# EAGLE board motor_power_avr (EAGLE 4.16)
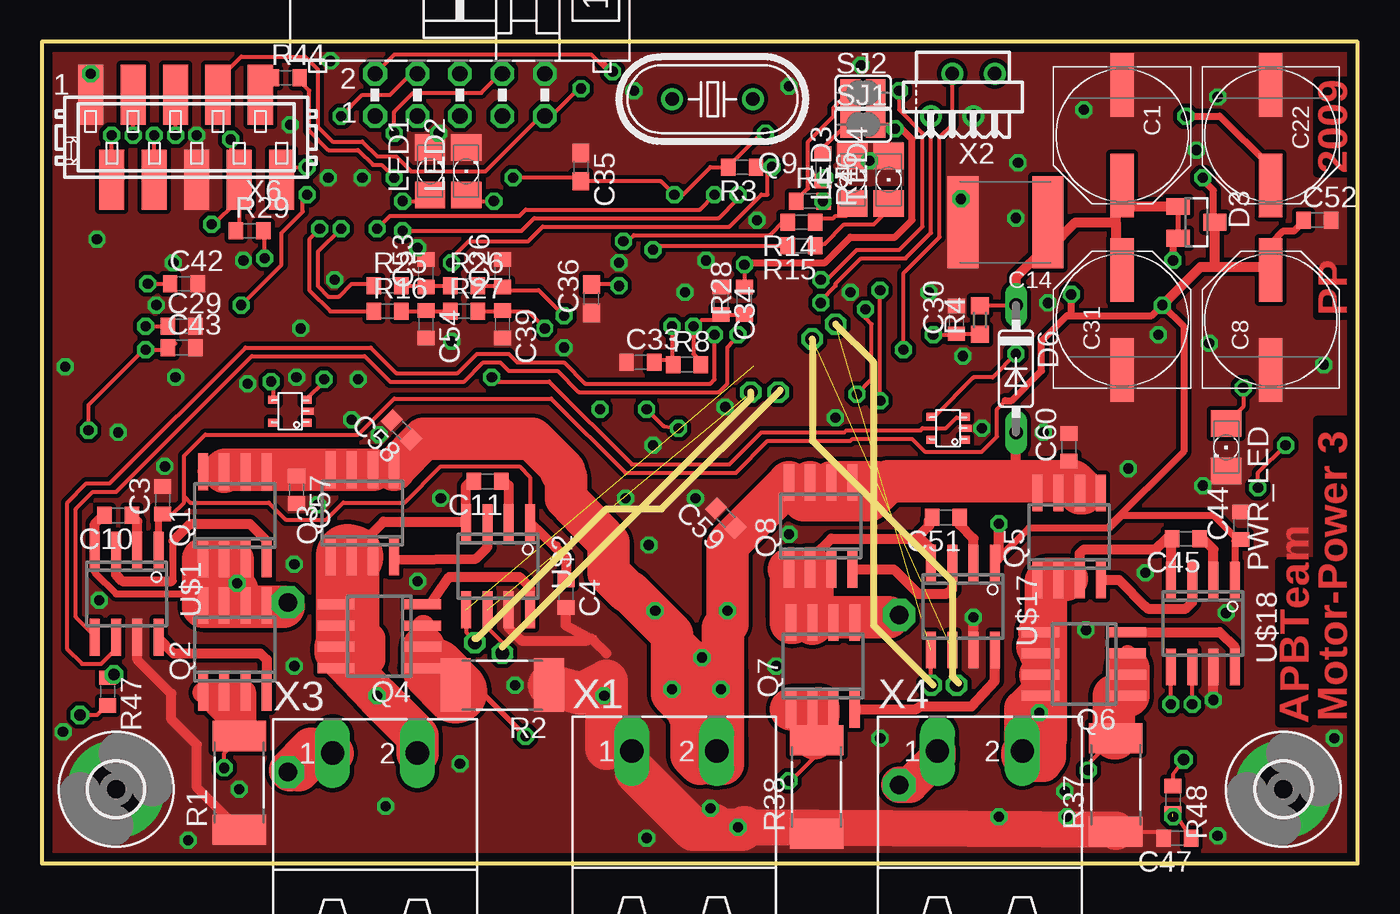
[diagram p1: board, top side]
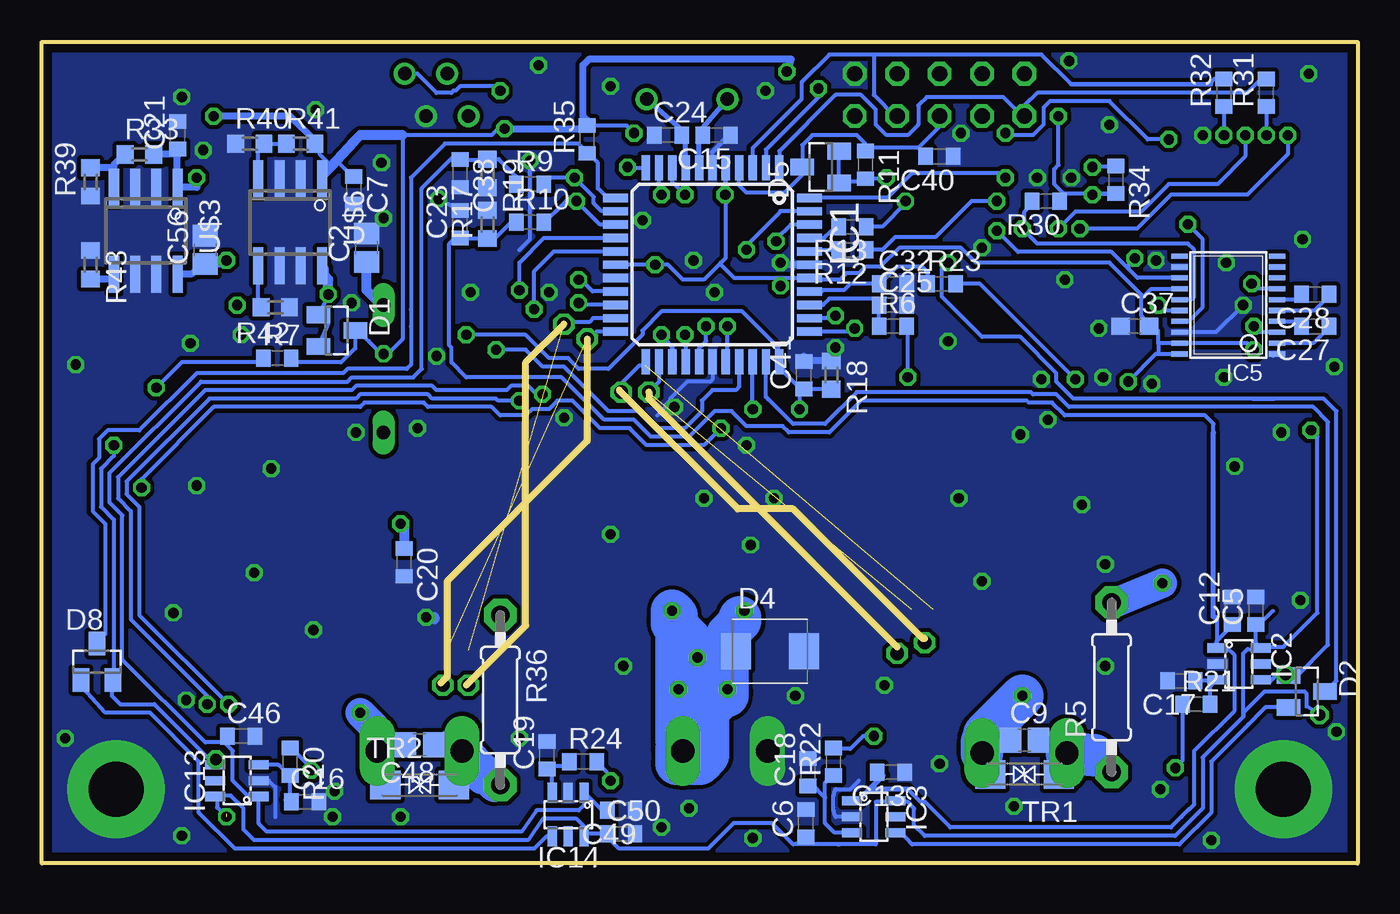
[diagram p2: board, bottom side, seen from below]

Size 78.74 x 49.15 mm. Coordinates in mm from the lower left corner, seen from the top.
Outline: 0,0 78.74,0 78.74,49.15 0,49.15 0,0
Copper layers (1*16): Top 0.035mm / dielectric 1.5mm / Bottom 0.035mm
Design rules "10mils": minimum track width 10mil, minimum drill 24mil, track to track 10mil, track to pad 10mil, pad to pad 10mil, via to via 10mil, smd to smd 0mil, copper to edge 20mil, drill to drill 10mil, minimum pad ring 10mil, minimum via ring 8mil, stop-mask expansion 0mil, vias tented up to drill 0mil, thermal gap 10mil
Milling: 13 lines

## Footprints (pad centres in the part's own frame; a part is rotated, then mirrored left to right if it is on the bottom)
PANASONIC_E = smd 3.8 x 1.4: + 3,0; - -3,0
C0805 = smd 1.3 x 1.5: 1 -0.85,0; 2 0.85,0
0603_SMALL = smd 0.864 x 1.016: 1 -0.825,0; 2 0.825,0
C2220K = smd 1.85 x 5.5: 1 -2.55,0; 2 2.55,0
C0603 = smd 1.1 x 1: 1 -0.85,0; 2 0.85,0
SOT23 = smd 1 x 1.4: 1 -0.95,-1.1; 2 0.95,-1.1; 3 0,1.1
SMBJ = smd 1.78 x 2.16: A 2.04,0; C -2.03,0
DO35-7 = drill 0.813 long: A 3.81,0; C -3.81,0
3,3-PAD = drill 3.3 pad 5.842 round: B3,3 0,0
TQFP44 = smd 1.5 x 0.5: 1 -5.8,4; 2 -5.8,3.2; 3 -5.8,2.4; 4 -5.8,1.6; 5 -5.8,0.8; 6 -5.8,0; 7 -5.8,-0.8; 8 -5.8,-1.6; 9 -5.8,-2.4; 10 -5.8,-3.2; 11 -5.8,-4; 23 5.8,-4; 24 5.8,-3.2; 25 5.8,-2.4; 26 5.8,-1.6; 27 5.8,-0.8; 28 5.8,0; 29 5.8,0.8; 30 5.8,1.6; 31 5.8,2.4; 32 5.8,3.2; 33 5.8,4 | smd 0.5 x 1.5: 12 -4,-5.8; 13 -3.2,-5.8; 14 -2.4,-5.8; 15 -1.6,-5.8; 16 -0.8,-5.8; 17 0,-5.8; 18 0.8,-5.8; 19 1.6,-5.8; 20 2.4,-5.8; 21 3.2,-5.8; 22 4,-5.8; 34 4,5.8; 35 3.2,5.8; 36 2.4,5.8; 37 1.6,5.8; 38 0.8,5.8; 39 0,5.8; 40 -0.8,5.8; 41 -1.6,5.8; 42 -2.4,5.8; 43 -3.2,5.8; 44 -4,5.8
SOT23-6 = smd 0.55 x 1.2: 1 -0.95,-1.3; 2 0,-1.3; 3 0.95,-1.3; 4 0.95,1.3; 5 0,1.303; 6 -0.95,1.3
TSSOP20 = smd 0.305 x 0.991: 1 -2.925,-2.918; 2 -2.275,-2.918; 3 -1.625,-2.918; 4 -0.975,-2.918; 5 -0.325,-2.918; 6 0.325,-2.918; 7 0.975,-2.918; 8 1.625,-2.918; 9 2.275,-2.918; 10 2.925,-2.918; 11 2.925,2.918; 12 2.275,2.918; 13 1.625,2.918; 14 0.975,2.918; 15 0.325,2.918; 16 -0.325,2.918; 17 -0.975,2.918; 18 -1.625,2.918; 19 -2.275,2.918; 20 -2.925,2.918
SOT363-5 = smd 0.6 x 0.48: 1 -1,0.7; 3 -1,-0.7; 4 1,-0.7; 5 1,0.7 | smd 0.7 x 0.4: 2 -1.05,0
1206 = smd 1.6 x 1.803: A -1.422,0; C 1.422,0
SO-08 = smd 0.6 x 2.2: 1 -1.905,-2.6; 2 -0.635,-2.6; 3 0.635,-2.6; 4 1.905,-2.6; 5 1.905,2.6; 6 0.635,2.6; 7 -0.635,2.6; 8 -1.905,2.6
HC49U70 = drill 0.813 round: 1 -2.413,0; 2 2.413,0
R2512 = smd 1.8 x 3.2: 1 -2.8,0; 2 2.8,0
R0603 = smd 1 x 1.1: 1 -0.85,0; 2 0.85,0
0207/10 = drill 1.1 pad 1.93 octagon: 1 -5.08,0; 2 5.08,0
SJ = smd 1.168 x 1.6: 1 -0.762,0; 2 0.762,0
ML10L = drill 0.914 octagon: 1 -5.08,-1.27; 2 -5.08,1.27; 3 -2.54,-1.27; 4 -2.54,1.27; 5 0,-1.27; 6 0,1.27; 7 2.54,-1.27; 8 2.54,1.27; 9 5.08,-1.27; 10 5.08,1.27
DO214AC_BIDIR = smd 1.8 x 1.7: P$1 -2.05,0; P$2 2.05,0
SO08 = smd 0.6 x 2.2: 1 -1.905,-2.6; 2 -0.635,-2.6; 3 0.635,-2.6; 4 1.905,-2.6; 5 1.905,2.6; 6 0.635,2.6; 7 -0.635,2.6; 8 -1.905,2.6
MSTBA2 = drill 1.397 long: 1 -2.54,5.08; 2 2.54,5.08
MICROMATCH-4-SIDE = drill 0.813 round: 1 1.905,1.27; 2 0.635,-1.27; 3 -0.635,1.27; 4 -1.905,-1.27
MICROMATCH-10-SMD = smd 1.5 x 3.58: 1 5.715,-2.54; 2 4.445,2.54; 3 3.175,-2.54; 4 1.905,2.54; 5 0.635,-2.54; 6 -0.635,2.54; 7 -1.905,-2.54; 8 -3.175,2.54; 9 -4.445,-2.54; 10 -5.715,2.54

## Placement (x,y rotation side)
C1  22µ/50V  [PANASONIC_E]  64.64,43.56 270 top
C2  100n/50V  [C0805]  59.31,36.83 90 bottom
C3  1u  [0603_SMALL]  7.24,21.72 90 top
C4  1u  [0603_SMALL]  31.37,16.13 270 top
C5  220n  [0603_SMALL]  6.1,15.11 90 bottom
C6  220n  [0603_SMALL]  33.02,2.41 90 bottom
C7  10u  [0603_SMALL]  60.07,40.26 270 bottom
C8  100µ  [PANASONIC_E]  73.53,32.51 90 top
C9  100n/50V  [C0805]  19.94,7.37 0 bottom
C10  220n  [0603_SMALL]  4.57,20.83 180 top
C11  220n  [0603_SMALL]  26.67,22.86 180 top
C12  220n  [0603_SMALL]  7.49,15.11 90 bottom
C13  220n  [0603_SMALL]  27.94,5.46 180 bottom
C14  10µ/50V  [C2220K]  57.66,38.35 180 top
C15  22p  [0603_SMALL]  38.35,43.56 180 bottom
C16  220p  [0603_SMALL]  62.99,3.68 0 bottom
C17  220p  [0603_SMALL]  10.54,10.92 180 bottom
C18  220p  [0603_SMALL]  32.89,5.46 90 bottom
C19  220p  [0603_SMALL]  48.51,6.48 90 bottom
C20  1u  [0603_SMALL]  57.07,18 270 bottom
C21  10u  [0603_SMALL]  70.61,43.56 90 bottom
C22  47µ  [PANASONIC_E]  73.53,43.56 270 top
C23  1u  [0603_SMALL]  53.72,38.23 90 bottom
C24  22p  [0603_SMALL]  41.27,43.56 0 bottom
C25  220n  [0603_SMALL]  27.81,33.4 0 bottom
C26  10n  [0603_SMALL]  27.56,35.31 90 top
C27  100n  [0603_SMALL]  2.54,32.13 180 bottom
C28  330n  [0603_SMALL]  2.54,34.04 180 bottom
C29  330n  [0603_SMALL]  8.38,32.13 0 top
C30  10n  [0603_SMALL]  54.74,32.51 90 top
C31  22µ/50V  [PANASONIC_E]  64.64,32.51 90 top
C32  220n  [0603_SMALL]  27.81,34.67 0 bottom
C33  220n  [0603_SMALL]  35.81,29.97 0 top
C34  220n  [0603_SMALL]  40.64,33.66 270 top
C35  220n  [C0603]  32.26,41.66 270 top
C36  220n  [C0603]  32.89,33.78 90 top
C37  220n  [C0603]  13.34,32.13 0 bottom
C38  1u  [0603_SMALL]  53.72,41.27 270 bottom
C39  10n  [0603_SMALL]  27.56,32.26 270 top
C40  220n  [0603_SMALL]  25.02,42.29 180 bottom
C41  10n  [0603_SMALL]  33.15,29.21 90 bottom
C42  330n  [0603_SMALL]  8.51,34.67 0 top
C43  220n  [0603_SMALL]  8.38,30.86 0 top
C44  1u  [0603_SMALL]  71.75,20.19 90 top
C45  220n  [0603_SMALL]  68.45,19.43 180 top
C46  220n  [0603_SMALL]  66.8,7.62 0 bottom
C47  220n  [0603_SMALL]  67.94,1.52 180 top
C48  100n/50V  [C0805]  56.13,7.11 180 bottom
C49  220n  [0603_SMALL]  44.07,3.17 180 bottom
C50  220n  [0603_SMALL]  44.07,1.78 0 bottom
C51  220n  [0603_SMALL]  54.1,20.7 180 top
C52  1u  [0603_SMALL]  76.33,38.48 0 top
C53  10n  [0603_SMALL]  22.99,35.31 90 top
C54  10n  [0603_SMALL]  22.99,32.26 270 top
C56  100n/50V  [C0805]  68.96,36.7 90 bottom
C57  10n  [0603_SMALL]  15.24,22.35 270 top
C58  10n  [0603_SMALL]  21.52,25.92 135 top
C59  10n  [0603_SMALL]  40.93,20.66 135 top
C60  10n  [0603_SMALL]  61.47,24.89 90 top
D1  [SOT23]  61.09,31.88 270 bottom
D2  [SOT23]  3.05,10.29 270 bottom
D3  [SOT23]  69.09,38.35 270 top
D4  SMBJ28A  [SMBJ]  35.18,12.7 0 bottom
D5  [SOT23]  32.13,41.66 90 bottom
D6  1N5819  [DO35-7]  58.29,29.59 270 top
D8  [SOT23]  75.44,12.06 0 bottom
H1  MOUNT-PAD-ROUND3.3  [3,3-PAD]  4.45,4.45 0 top
H2  MOUNT-PAD-ROUND3.3  [3,3-PAD]  74.3,4.45 0 top
IC1  MEGA16-A  [TQFP44]  38.61,35.81 270 bottom
IC2  LM331DBV  [SOT23-6]  7.11,11.94 270 bottom
IC3  LM331DBV  [SOT23-6]  28.96,2.79 270 bottom
IC5  MAX3223EUP  [TSSOP20]  7.75,33.4 90 bottom
IC8  MCP9701"  [SOT363-5]  54.23,26.04 180 top
IC10  MCP9701"  [SOT363-5]  14.86,27.05 180 top
IC13  LM331DBV  [SOT23-6]  67.06,4.95 90 bottom
IC14  LM331DBV  [SOT23-6]  47.24,2.92 180 bottom
LED1  [1206]  23.24,41.4 90 top
LED2  [1206]  25.4,41.4 90 top
LED3  [1206]  48.51,40.89 90 top
LED4  [1206]  50.67,40.89 90 top
PWR_LED  [1206]  70.87,24.89 270 top
Q1  [SO-08]  11.56,20.83 0 top
Q2  [SO-08]  11.56,12.83 0 top
Q3  [SO-08]  19.18,20.95 0 top
Q4  [SO-08]  20.19,13.59 90 top
Q5  [SO-08]  61.47,19.56 0 top
Q6  [SO-08]  62.36,11.94 90 top
Q7  [SO-08]  46.74,11.81 0 top
Q8  [SO-08]  46.61,20.19 0 top
Q9  14.7456M  [HC49U70]  40.13,45.72 180 top
R1  5mOhm  [R2512]  11.81,4.83 90 top
R2  5mOhm  [R2512]  27.56,10.67 180 top
R3  1k  [0603_SMALL]  41.91,41.66 180 top
R4  464k  [R0603]  56.13,32.51 90 top
R5  Polys_15A  [0207/10]  14.73,10.54 90 bottom
R6  1k  [0603_SMALL]  27.81,32.13 0 bottom
R7  2.15k  [0603_SMALL]  64.64,30.23 0 bottom
R8  10k  [0603_SMALL]  38.61,29.84 0 top
R9  46.4k  [0603_SMALL]  49.53,40.64 0 bottom
R10  46.4k  [0603_SMALL]  49.53,38.35 0 bottom
R11  10k  [0603_SMALL]  29.46,41.78 270 bottom
R12  2.15k  [0603_SMALL]  30.23,36.7 180 bottom
R13  2.15k  [0603_SMALL]  30.23,38.1 180 bottom
R14  2.15k  [0603_SMALL]  45.47,38.35 180 top
R15  2.15k  [0603_SMALL]  45.47,36.96 180 top
R16  21.5k  [0603_SMALL]  20.7,33.02 0 top
R17  1k  [R0603]  52.07,38.23 90 bottom
R18  100k  [R0603]  31.5,29.21 270 bottom
R19  1k  [R0603]  52.07,41.27 270 bottom
R20  4.64k  [0603_SMALL]  63.88,6.1 270 bottom
R21  4.64k  [0603_SMALL]  9.65,9.53 0 bottom
R22  4.64k  [0603_SMALL]  31.37,6.1 90 bottom
R23  1k  [0603_SMALL]  24.89,34.67 0 bottom
R24  4.64k  [0603_SMALL]  46.35,6.1 0 bottom
R25  21.5k  [0603_SMALL]  20.7,34.54 0 top
R26  10k  [0603_SMALL]  25.27,34.54 0 top
R27  10k  [0603_SMALL]  25.27,33.02 0 top
R28  10  [0603_SMALL]  42.04,33.66 90 top
R29  2.15k*  [0603_SMALL]  12.45,37.85 0 top
R30  2.15k*  [0603_SMALL]  18.67,39.62 180 bottom
R31  2.15k  [0603_SMALL]  5.46,46.1 90 bottom
R32  2.15k  [0603_SMALL]  8,46.1 90 bottom
R33  68k  [R0603]  72.9,42.42 0 bottom
R34  2.15k  [0603_SMALL]  14.48,40.89 270 bottom
R35  1k  [0603_SMALL]  46.1,43.31 90 bottom
R36  Polys_15A  [0207/10]  51.31,9.78 270 bottom
R37  5mOhm  [R2512]  64.26,4.7 90 top
R38  5mOhm  [R2512]  46.35,4.57 90 top
R39  10k  [R0603]  75.82,40.77 90 bottom
R40  10k  [R0603]  66.29,43.05 0 bottom
R41  31.7k  [R0603]  63.25,43.05 0 bottom
R42  2.15k  [R0603]  64.77,33.27 180 bottom
R43  2.15k  [R0603]  75.82,35.81 270 bottom
R44  2.15k  [0603_SMALL]  14.61,46.99 0 top
R45  2.15k  [0603_SMALL]  45.97,39.62 0 top
R46  2.15k  [0603_SMALL]  46.74,41.66 270 top
R47  1k  [0603_SMALL]  3.94,10.29 270 top
R48  1k  [0603_SMALL]  67.69,3.81 270 top
SJ1  [SJ]  49.15,44.2 0 top
SJ2  [SJ]  49.15,46.1 0 top
SV1  [ML10L]  25.02,45.97 0 top
TR1  SMAJ30CA-TR__DO214AC  [DO214AC_BIDIR]  19.94,5.33 180 bottom
TR2  SMAJ30CA-TR__DO214AC  [DO214AC_BIDIR]  56.13,4.7 0 bottom
U$1  ISL2110SOIC  [SO08]  5.08,16.13 180 top
U$2  ISL2110SOIC  [SO08]  27.3,17.78 180 top
U$3  LM2931ADJD  [SO08]  72.52,37.85 180 bottom
U$6  LM2931ADJD  [SO08]  63.88,38.35 180 bottom
U$17  ISL2110SOIC  [SO08]  55.12,15.37 180 top
U$18  ISL2110SOIC  [SO08]  69.47,14.35 180 top
X1  MSTBA2  [MSTBA2]  37.85,1.65 0 top
X2  MICROMATCH-4-SIDE  [MICROMATCH-4-SIDE]  55.12,45.97 180 top
X3  MSTBA2  [MSTBA2]  19.94,1.52 0 top
X4  MSTBA2  [MSTBA2]  56.13,1.65 0 top
X6  MICROMATCH-10-SMD  [MICROMATCH-10-SMD]  8.64,43.43 180 top

## Tracks (layer width: path | path; a pad name or v marks a point on that pad's centre or on a via)
0V  (via drill 0.61, 0.61 pad 0.81)
  Top 0.254: 12.13,1.97 12,2.1 R1.1 | C47.2 66.74,1.91 65.79,1.91 R37.1 | C14.2 54.98,38.47 54.99,38.48 54.86,38.61 v54.99,39.75 | LED4.C 49.55,42.32 v49.53,42.04
  Top 0.406: v34.54,35.94 34.8,35.94
  Top 0.61: U$2.7 27.94,14.1 28.7,13.34 32.64,13.34 32.77,13.46 32.89,13.46 33.02,13.34 | 33.02,13.34 33.78,12.57 | C4.2 31.37,14.22 33.02,13.34 | U$17.7 v55.75,14.73 | v70.1,9.78 U$18.7 | U$1.7 5.71,12.19 7.75,10.16 7.75,8.64 9.27,7.11 9.27,4.57 R1.1
  Top 1.27: 12.2,2.04 12.13,1.97 11.94,1.78
  Top 2.184: 42.04,2.16 64.26,2.03 R37.1
  Top 2.54: R2.1 32.26,10.16 33.78,10.92 33.78,6.86 | 40.01,2.03 38.99,2.03 35.56,5.46 | 40.01,2.03 41.9,2.03 42.04,2.16 | 40.26,2.29 40.01,2.03
  Bottom 0.254: 6.22,16 6.16,15.94 C5.2 | IC13.2 65.15,4.95 64.77,4.57 64.77,2.79 | C23.2 54.17,39.31 v54.99,39.75 | IC5.18 8.48,31.78 v6.86,33.4 | v55.12,30.35 55.12,30.61 | IC1.28 38.61,28.96 38.73,28.83 40.13,28.83 41.15,27.81 41.15,27.69 41.4,27.43 41.4,27.3 41.91,26.8 | IC3.2 31.24,2.79 31.37,3.17 31.37,4.06 31.24,4.45 30.35,4.45 29.84,4.95 | IC1.6 38.61,42.55 | 5.2,30.48 5.21,30.48 | IC5.1 5.2,30.48 | 5.2,30.48 5.08,30.35 | v49.53,42.04 49.53,37.34 50.16,36.7
  Bottom 0.305: 38.61,42.55 37.85,43.31
  Bottom 0.406: 33.27,30.04 33.27,29.97 | 33.27,30.04 C41.2 33.15,30.35 | R18.1 33.27,30.06 33.27,30.04 | IC1.39 34.42,35.81 v34.54,35.94
  Bottom 0.61: v55.75,14.73 55.24,14.73 55.24,14.61 | v70.1,9.78 69.98,9.78
  other vias: 41.66,2.16 12.06,36.07 62.36,45.09 58.42,41.91 66.8,31.62 69.85,31.11 76.71,29.84 7.37,23.75 15.11,11.81 1.27,7.87 1.4,29.72 8,29.08 11.81,4.45 20.57,3.43 77.34,7.49 62.48,13.97 57.28,2.79 28.32,10.67 38.48,34.16 24.51,31.24 15.49,32 35.43,46.23 49.02,47.75 47.5,26.67 40.89,27.3 3.43,15.75 4.57,25.78 39.12,21.84 36.32,19.05 18.54,26.54 18.92,28.96 15.11,17.91 22.48,16.89 25.02,5.97 40.01,3.3 66.04,17.4 65.02,23.62 69.47,22.61 69.09,42.67 12.32,28.7 33.66,10.03 43.94,11.81 70.87,14.99 16.51,21.46 59.94,25.78 42.8,38.48 44.7,46.48 60.2,33.53 36.2,1.52 20.19,25.65 48.39,34.16 53.09,34.16 3.3,37.34 7.87,35.94 17.14,41.02 9.27,43.56 2.92,47.24 19.18,41.02 23.75,43.69 14.86,44.2 39.75,36.07 31.24,30.86 23.88,21.84 17.27,48.01 61.34,2.79 61.21,4.32 50.16,7.49 15.24,29.08 17.53,34.92 22.48,36.83 44.7,19.68 8.76,1.4 70.36,1.65 58.29,38.61 70.36,45.85 36.58,25.02 34.92,21.84 56.26,26.04
  pour Bottom (isolate 0.254, no thermals): 0.51,0.51 78.23,0.51 78.23,48.64 0.51,48.64
  pour Top (isolate 0.254, no thermals): 0.25,0.25 78.49,0.25 78.49,48.9 0.25,48.9
+5V  (via drill 0.61, 0.61 pad 1.02, 0.7 pad 1.02)  (1 unrouted)
  Top 0.254: 68.71,1.52 C47.1 67.94,2.79 v67.69,2.79 | 7.49,30.73 v6.22,30.73 6.1,30.73 2.79,27.43 v2.79,25.91 | 7.49,30.73 7.62,30.86 | 7.49,30.73 7.56,30.8 C43.1 7.62,30.86 | IC10.4 13.86,28.72 v13.72,28.83 | 42.04,35.69 R28.2 | IC8.4 53.41,26.73 55.75,29.08 56.9,29.08 v58.29,30.48 | v28.19,41.02 28.45,41.15 28.45,41.02 31.75,41.02 C35.2 37.05,40.81 v37.85,40.01 38.35,40.01 40.01,41.66 41.02,41.66 | C36.2 34.46,34.63 v34.54,34.54 | 8,31.11 7.87,31.11 7.62,30.86 | 33.66,47.75 33.53,47.75 32.89,48.39 21.08,48.39 SV1.2 | 41.02,41.66 R3.2 | 41.02,41.66 43.05,43.69 v43.31,43.69 | SJ1.2 50.8,44.2 v51.05,43.94 | SJ1.2 49.91,45.97 | 49.4,46.74 49.4,45.47 49.91,45.97 | 49.4,44.58 49.4,43.56 | 49.91,45.97 SJ2.2 | SJ1.2 49.78,44.2 49.4,44.58 | 49.4,44.58 49.4,44.83 | R47.2 3.94,9.53 3.3,8.89 v2.29,8.89
  Top 0.406: 42.04,35.69 v42.04,35.81 41.91,35.81 42.04,35.94 46.86,35.94 48.39,37.47 51.05,37.47 52.07,38.48 52.07,43.31 51.31,44.07 50.8,44.07 v51.05,43.94 | v34.16,47.37 34.04,47.37 33.66,47.75 | v68.45,44.7 70.48,44.7 73.41,41.78 73.41,40.77 73.53,40.64 C22.+
  Bottom 0.254: 46.23,1.65 46.26,1.62 IC14.6 46.23,1.62 46.23,1.78 | IC2.6 5.81,12.92 6.1,13.21 C5.1 5.91,14.29 5.08,15.11 | 30.99,1.14 28.83,1.14 28.83,3.68 27.81,3.68 | 30.99,1.14 31.11,1.14 | IC2.6 5.91,12.89 5.97,12.83 6.6,12.83 6.86,12.57 6.86,8.76 | 27.81,3.68 27.75,3.74 IC3.6 | 27.81,3.68 26.92,3.68 26.54,3.3 26.54,2.29 25.91,1.65 10.92,1.65 9.27,3.3 9.27,6.35 6.86,8.76 | 30.99,1.14 33.78,1.14 | 33.78,1.14 35.05,2.41 37.34,2.41 38.86,0.89 44.2,0.89 44.83,1.52 C50.1 46.23,1.78 | 68.58,4.06 68.61,4.03 IC13.6 68.26,4 | 68.26,4 68.2,4.06 67.44,4.06 66.67,3.3 66.67,2.03 66.04,1.4 49.66,1.4 48.77,2.67 46.74,2.67 46.23,2.16 46.23,1.78 | 68.26,4 68.26,3.36 v67.69,2.79 | 34.29,35.01 IC1.38 32.13,34.92 30.99,34.92 30.61,35.31 29.84,35.31 29.46,35.69 28.57,35.69 27.43,36.83 23.75,36.83 22.86,35.94 14.86,35.94 12.83,33.91 | 34.29,35.01 37.3,35.01 38.1,35.81 38.1,35.94 | v42.04,35.81 IC1.17 | 38.1,35.94 37.81,36.23 IC1.5 37.81,41.49 37.72,41.4 37.85,41.27 v37.85,40.01 | R11.2 29.46,41.15 | 5.96,30.48 v6.22,30.73 6.62,31.13 IC5.19 10.66,31.12 10.67,31.11 11.94,31.11 | 11.94,31.11 11.94,30.48 | 11.94,30.48 IC5.20 | IC5.20 10.54,30.48 | v13.72,28.83 12.06,30.48 11.94,30.48 | D5.2 31.03,41.19 30.99,41.15 31.03,41.1 D5.1 30.67,40.71 30.61,40.77 29.72,40.77 29.53,40.95 29.53,40.96 29.46,40.89 R11.2 | R11.2 28.26,40.96 v28.19,41.02 | IC1.17 44.45,35.81 | v42.04,35.81 IC1.17 | R35.2 43.75,44.13 v43.31,43.69 | 34.29,35.01 34.29,34.8 v34.54,34.54 | C6.1 33.02,1.65 32.64,1.52 33.78,1.14 | v2.79,25.91 2.41,25.53 2.41,14.99 4.45,12.95 6.1,12.95 6.03,12.89 IC2.6 | IC5.20 | 11.94,31.11 11.94,31.88 12.45,32.38 C37.2 12.48,32.22 12.45,32.26 12.95,32.77 12.95,33.78 12.83,33.91
  Bottom 0.254: IC5.14 12.36,34.38 12.83,33.91 | v42.04,35.81 41.27,35.81 40.39,34.92 39.12,34.92 38.1,35.94 | 57.91,30.61 v58.29,30.48 | 57.91,30.61 57.15,31.37 57.15,43.56 51.82,43.56 51.44,43.94 v51.05,43.94 | 57.91,30.61 58.55,30.61 59.18,31.24 D1.3 59.99,30.82 60.83,29.97 64.14,29.97 R7.2 | C7.1 60.13,41.08 61.09,42.04 | R41.2 62.4,42.84 62.1,42.55 62.1,42.42 61.4,41.72 | 6.86,8.76 6.86,9.02 5.59,10.29 3.17,10.29 3.05,10.16 3.05,9.4 v2.29,8.89
  Bottom 0.406: v51.05,43.94 46.23,43.94 46.1,44.07 R35.2 46.1,44.2 45.97,44.32 46.35,44.7 46.35,47.75 45.97,48.13 33.91,48.13 v34.16,47.37 | 62.4,42.84 62.4,43.22 63.88,44.7 v68.45,44.7
  Bottom 0.61: U$6.1 61.98,41.15 61.4,41.72 61.09,42.04 60.06,43.17 60.07,43.18 59.69,43.56 57.15,43.56
INT*  (via drill 0.61)
  Top 0.254: v51.56,30.73 51.56,35.31 53.72,37.47 53.72,43.43 54.48,44.2 X2.2
  Bottom 0.254: IC1.30 37.01,28.52 37.21,28.32 38.61,28.32 39.24,27.69 39.24,27.05 40.26,26.04 42.04,26.04 43.05,27.05 44.83,27.05 47.5,29.72 48.77,29.72 49.78,30.73 v51.56,30.73
LIM_L  (via drill 0.61)
  Top 0.254: v24.51,35.94 24.51,36.2 25.53,37.21 29.08,37.21 29.97,38.1 41.15,38.1 43.05,40.01 43.43,40.01 43.43,41.4 v43.69,41.66 R3.1
  Bottom 0.254: D2.3 1.69,10.5 1.27,10.92 1.27,27.05 2.03,27.81 6.35,27.81 | IC1.11 42.67,41.66 42.71,41.61 43.39,41.61 v43.69,41.66 | 6.35,27.81 4.95,27.81 | 6.35,27.81 17.02,27.81 18.03,28.83 18.03,29.34 20.19,31.5 22.48,31.5 24.89,33.91 24.89,35.56 v24.51,35.94
LIM_L_A  (via drill 0.7 pad 1.02)
  Top 0.254: 3.94,11.3 R47.1 v4.32,11.3
  Bottom 0.254: D2.1 4.89,11.24 5.21,10.92 5.71,10.92 5.78,10.99 IC2.4 | D2.1 3.62,11.24 1.78,13.08 1.78,26.42 2.67,27.3 17.27,27.3 18.03,28.07 19.43,28.07 19.56,28.19 29.97,28.19 31.88,26.29 33.78,26.29 35.05,27.56 | 35.05,27.56 35.31,27.81 | IC1.32 35.41,27.91 35.05,27.56 | D2.1 3.89,11.09 v4.32,11.3
LIM_L_B
  Bottom 0.254: IC3.4 27.27,1.81 26.67,1.14 10.67,1.14 8.76,3.05 8.76,6.1 6.73,8.13 | 6.73,8.13 6.48,8.38 | D2.2 5.52,9.34 6.73,8.13
LIM_R
  Bottom 0.254: 56.64,33.15 56.64,41.02 54.61,43.05 46.61,43.05 46.1,42.55 R35.1 46.04,42.48 45.47,41.91 45.47,40.39 44.96,39.88 44.45,39.88 44.41,39.84 IC1.12 | 56.64,33.15 56.64,32.13 | 56.64,33.15 56.64,29.84 56.9,29.59 60.45,29.59 60.71,29.34 69.47,29.34 72.9,25.91 74.8,25.91 75.31,25.4 75.31,24.26 75.69,23.88 75.69,21.08 74.93,20.32 74.93,13.72 75.44,13.21 D8.3
LIM_R_A  (via drill 0.61 pad 1.02, 0.7 pad 1.02)
  Top 0.254: v36.2,27.18 37.21,26.16 v38.1,26.04 | R48.1 67.69,5.33 v68.33,6.22 | v72.77,22.48 72.77,23.37 v74.42,25.02
  Bottom 0.254: IC1.31 36.21,27.29 v36.2,27.18 | v38.1,26.04 39.12,25.02 42.55,25.02 43.56,26.04 45.34,26.04 46.99,27.69 47.88,27.69 48.39,27.18 49.4,27.18 49.78,26.8 51.31,26.8 51.82,27.3 55.63,27.3 55.88,27.56 59.44,27.56 59.69,27.3 68.45,27.3 72.77,22.99 v72.77,22.48 | v68.33,6.22 68.45,5.84 68.39,5.9 IC13.4 68.39,5.9 72.01,9.53 74.04,9.53 74.55,10.03 74.55,10.79 74.68,10.79 D8.2 74.51,10.96 | v74.42,25.02 74.42,24.38 75.18,23.62 75.18,21.34 74.42,20.57 74.42,11.05 74.51,10.96 | 74.51,10.96 74.55,10.92
LIM_R_B
  Bottom 0.254: IC14.4 48.54,1.62 49.28,0.89 67.18,0.89 69.34,3.05 69.34,6.1 72.26,9.02 74.93,9.02 76.27,10.47 | 76.27,10.47 76.33,10.54 | D8.1 76.26,10.48 76.27,10.47
N$1
  Bottom 0.305: IC1.7 39.41,43.27 39.24,43.43 C15.2 39.18,44.01 Q9.2
N$2
  Bottom 0.305: IC1.8 40.21,43.26 40.39,43.43 C24.2 40.45,43.88 Q9.1
N$3  (via drill 0.61)
  Top 0.254: v26.92,29.08 27.18,28.83 30.35,28.83 35.31,23.88 41.15,23.88 43.05,25.78 48.01,25.78 48.13,25.91 52.58,25.91 52.7,26.04 54.1,26.04 54.74,26.67 55.37,26.67 55.36,26.69 IC8.3
  Bottom 0.254: R6.2 26.8,32.13 26.92,32 v26.92,29.08
N$4  (via drill 0.61)
  Top 0.254: R4.2 58.25,33.36 D6.C
  Top 0.305: D3.2 67.99,37.42 67.94,37.47 67.99,37.51 D3.1
  Top 0.406: D3.2 67.88,37.4 67.69,37.21 v67.69,36.07
  Top 0.61: 60.08,36.84 C14.1 | 60.08,36.84 58.29,35.05 D6.C 58.17,33.27 | 60.08,36.84 60.34,36.84 61.85,38.35 64.26,38.35 | 64.26,38.35 64.26,39.37 | 64.26,39.37 64.58,39.56 | 64.58,39.56 64.9,39.88 64.77,39.88 | 64.77,39.88 64.64,39.88 64.52,39.75 64.64,39.75 64.77,39.88 | C31.+ 64.26,37.21 64.26,38.35 | D3.1 64.84,39.3 64.58,39.56 | C1.+ 64.64,39.62 64.26,39.37
  Bottom 0.406: U$3.8 69.78,35.25 69.09,35.94 69,35.85 C56.1 67.91,35.85 v67.69,36.07
  Bottom 0.61: D6.C 58.42,33.4 59.31,34.29 C2.1
N$5  (via drill 0.61)
  Top 0.254: 37.72,29.97 37.59,29.84 | v37.72,32.13 37.72,29.97 | 37.59,29.84 R8.1 | 37.59,29.84 37.53,29.84 | C33.2 36.64,30.04 36.7,30.1 37.72,30.1 37.66,30.04 37.72,29.97
  Bottom 0.254: v37.72,32.13 37.72,29.97 37.76,30.01 IC1.29
N$6  (via drill 0.61)
  Top 0.254: LED2.A 25.4,40.13 25.91,39.62 v27.05,39.62
  Bottom 0.254: v27.05,39.62 27.05,39.5 28.45,38.1 R13.1
N$7  (via drill 0.61)
  Top 0.254: R28.1 C34.2 40.58,32.83 | 40.58,32.83 40.51,32.77 | 40.58,32.83 40.26,32.51 39.5,32.51 v38.99,32.13 38.99,30.48 39.37,30.1 39.37,29.84 R8.2
  Bottom 0.254: IC1.27 39.41,30.82 38.99,31.24 v38.99,32.13
N$8
  Top 0.406: 7.87,19.3 7.87,16.89 7.75,16.89
  Top 0.61: Q1.4 13.46,19.3 12.45,20.32 8.89,20.32 7.87,19.3 | 7.75,16.89 4.83,16.89 4.45,17.27 U$1.3
N$9
  Top 0.254: 52.61,19.43 52.45,19.37 52.45,19.43 | 50.67,14.73 51.56,14.73 R36.1
  Top 0.406: Q8.3 46.8,17.59 46.35,18.03 | Q7.7 Q7.6 | Q7.6 Q7.5 | Q7.5 48.84,14.41 48.9,14.35 | Q7.6 47.37,14.48 47.44,14.41 Q7.5
  Top 0.61: 47.12,19.3 46.35,18.54 46.35,18.03 | 47.12,19.3 47.18,19.36 | Q8.2 45.97,17.65 | 52.45,19.43 47.24,19.43 47.12,19.3 | U$17.4 53.21,18.83 52.61,19.43 52.61,19.72 53.09,20.19 53.09,20.57 53.21,20.7 C51.2
  Top 1.27: Q8.2 46.1,17.59 46.1,17.65 46.1,18.03 46.35,18.03
  Top 2.54: Q7.8 44.96,14.41 44.96,14.73 | 44.96,14.73 50.67,14.73 | 44.83,17.59 44.83,17.65 | 44.83,17.59 Q8.1 45.85,17.59 | 44.96,14.73 44.83,14.73 44.83,17.59 | 45.85,17.59 Q8.2 | 45.85,17.59 45.85,17.65 | 46.1,14.35 Q7.7 46.1,17.65 45.97,17.65
N$10  (via drill 0.61)
  Top 0.254: 59.34,6.76 59.44,6.67 | Q6.6 59.75,12.38 Q6.7 59.75,10.16 Q6.8 | Q5.1 59.75,17.14 60.07,16.89 | Q5.3 62.29,17.14 61.34,17.02
  Top 0.61: 67.56,19.43 67.44,19.43 67.56,19.3 U$18.4 | Q5.3 62.1,18.54 62.36,18.8 66.67,18.8 67.31,19.43 67.56,19.43 | 67.56,19.43 C45.2
  Top 1.676: v59.69,9.02 59.69,10.41 59.56,10.54
  Top 2.184: Q6.8 59.44,10.03 58.67,9.27 X4.2 | 58.48,6.67 58.48,6.41 58.93,5.97 59.94,5.97 60.2,6.35 60.2,7.11 60.01,7.43
  Top 2.54: Q5.2 61.28,16.96 61.34,17.02 60.2,17.02 60.07,16.89 | 60.07,16.89 60.07,7.49 60.01,7.43 59.34,6.76 59.31,6.73 | 60.07,16.89 60.07,14.22 59.69,13.84 Q6.5 59.76,13.15 59.56,12.95 59.76,12.76 Q6.6 | Q6.7
  Bottom 1.016: X4.2 58.8,6.6 | X4.2 58.67,6.86 58.04,7.49 C48.2 | TR2.P$1 58.18,6.24 X4.2
  Bottom 1.778: 58.8,6.6 58.8,8.13 v59.69,9.02
N$11  (via drill 0.61)
  Top 0.254: 9.65,9.91 Q2.1 | 9.65,9.91 11.81,7.75 R1.2 11.81,7.49 10.92,6.6 v10.92,5.71 | 9.65,9.91 10.41,9.91 11.56,8.76 11.56,7.11
  Top 1.27: Q2.3 12,10.23 11.94,10.29 11.88,10.23 | Q2.1 Q2.2 | Q2.2 11.88,10.23 | 11.88,10.23 12.13,10.23 12.19,10.29 12.19,8.38 12.06,8.26 11.56,8.26 10.41,9.4 11.3,9.4 11.3,9.78 10.92,10.16 Q2.2
  Bottom 0.254: R21.1 10.48,6.16 v10.92,5.71
N$12  (via drill 0.61 pad 1.02)
  Top 0.254: 46.86,39.62 R45.2 v46.74,39.62
  Bottom 0.254: IC1.14 45.33,38.21 v46.74,39.62 47.37,39.62 48.01,38.99 R10.2
N$13  (via drill 0.61)
  Top 0.254: PWR_LED.A 70.99,26.42 71.88,27.3 v71.88,28.45
  Bottom 0.254: R7.1 65.53,30.23 65.79,29.97 70.36,29.97 v71.88,28.45
N$14  (via drill 0.61 pad 1.02)
  Top 0.254: v46.86,41.02 R46.2
  Bottom 0.254: IC1.13 45.24,39.01 45.72,39.5 45.72,39.88 v46.86,41.02 48.26,41.02 48.39,40.89 R9.2
N$15
  Top 0.254: 46.48,38.48 R14.1 46.23,38.35 46.48,38.61 47.37,38.61 47.5,38.73 48.13,38.73 48.9,39.5 LED3.A
N$16
  Top 0.61: C10.1 5.33,20.83 5.71,20.45 U$1.2
N$17
  Top 0.254: R15.1 46.86,37.08 48.01,38.23 49.78,38.23 51.05,39.5 LED4.A
N$18
  Top 0.61: Q2.4 13.46,12.19 13.08,12.57 7.87,12.57 6.99,13.46 U$1.8
N$19  (via drill 0.61)
  Top 0.254: v36.58,36.7 36.7,36.7 36.96,36.96 R15.2
  Bottom 0.254: IC1.43 34.54,39.01 34.54,38.99 36.58,36.96 v36.58,36.7
N$20
  Top 0.61: Q3.4 21.08,18.16 25.98,18.23 26.67,18.92 U$2.3
N$21  (via drill 0.61)
  Top 0.254: X6.10 14.35,41.4 14.61,41.4 14.86,41.66 v15.88,41.66
  Bottom 0.254: R34.1 15.81,41.72 v15.88,41.66
N$22
  Bottom 0.254: IC1.40 32.73,36.61 32.64,36.7 R12.2
N$23
  Bottom 0.254: IC1.41 31.93,37.41 31.5,37.85 31.37,37.85 31.18,38.04 R13.2
N$24  (via drill 0.61)
  Top 0.254: v34.8,37.21 35.18,37.34 35.43,37.59 43.56,37.59 44.45,38.48 R14.2
  Bottom 0.254: IC1.42 33.92,38.21 34.8,37.34 v34.8,37.21
N$25
  Bottom 0.254: R41.1 R40.2 65.53,43.05 65.79,42.8 U$6.4
N$26  (via drill 0.61)
  Top 0.254: LED1.A 23.37,40.13 22.86,39.62 v21.59,39.62
  Bottom 0.254: R12.1 28.45,36.7 27.69,37.47 25.27,37.47 23.11,39.62 v21.59,39.62
N$27
  Bottom 0.406: R33.1 73.79,42.42 74.42,41.78 74.42,41.66 | U$3.4 74.42,41.66 | R39.2 74.46,41.62 74.42,41.66
N$28
  Bottom 0.406: 74.33,34.96 74.42,35.05 U$3.5 | R43.2 74.33,34.96 | 74.33,34.96 74.3,34.92
N$29
  Bottom 0.254: R42.2 65.62,33.44 65.53,33.53 65.79,33.78 U$6.5
N$30
  Top 0.254: R44.1 13.34,46.86 13.08,46.61 X6.9
N$31
  Top 0.254: R46.1 46.86,42.93 48.13,44.2 SJ1.1 48.51,44.2 48.39,44.32 48.39,44.83 48.9,44.83 48.9,43.56
N$32
  Bottom 0.254: C27.2 3.3,32.13 3.6,32.43 IC5.4
N$33
  Bottom 0.254: IC13.3 64.58,5.9 63.88,5.21 R20.2 63.88,3.81 63.75,3.68 C16.1
  Bottom 0.305: C16.1 64.14,3.81 63.82,3.87
N$34
  Bottom 0.254: R21.2 8.83,10.6 8.51,10.92 | 8.51,10.92 8.44,10.99 IC2.3 | 8.51,10.92 C17.1
N$35
  Bottom 0.254: IC3.3 31.31,1.84 31.88,2.41 31.88,3.94 | C18.1 32.7,4.64 32.64,4.7 31.88,3.94 | R22.1 31.43,5.27 31.88,4.83 31.88,3.94
N$36
  Bottom 0.254: R24.1 47.24,6.1 47.5,5.84 48.26,5.84 48.39,5.71 | 48.39,5.71 48.51,5.59 C19.1 48.45,5.65 48.39,5.71 | IC14.3 48.19,5.52 48.39,5.71
N$37
  Bottom 0.254: C28.2 3.3,34.04 3.61,33.73 IC5.6
N$38  (via drill 0.61)
  Top 0.254: Q4.6 17.53,14.29 18.29,14.29 19.43,14.29 19.68,13.46 | 18.29,15.56 18.48,15.56 Q4.5 | Q3.1 17.53,18.41 18.29,18.41 | Q4.8 17.53,11.75 18.29,13.34 | 18.29,17.46 19.75,17.46 Q3.3
  Top 0.406: Q4.8 17.65,11.68 17.65,12.57 17.65,12.95 Q4.7 | Q3.3 19.81,19.81
  Top 0.61: 19.81,19.81 20.45,20.45 25.27,20.45 25.34,20.38 U$2.4 25.4,22.61 25.78,22.99 C11.2
  Top 1.778: 19.68,13.46 19.68,12.19
  Top 2.54: X3.2 22.48,7.62 v20.07,10.03 17.65,12.57 17.59,12.63 Q4.7
  Top 3.81: Q3.2 18.35,18.36 18.29,18.41 18.29,17.46 18.29,15.56 18.29,14.29 18.29,13.34
  Bottom 1.016: C9.1 21.97,7.49 22.48,7.24 | TR1.P$2 22.24,6.88 22.48,7.11
  Bottom 2.54: X3.2 22.48,7.11 22.48,7.24 22.35,7.75 v20.07,10.03
N$39  (via drill 0.61)
  Top 0.305: R2.2 26.42,10.16 v28.96,7.62
  Top 1.27: Q4.3 22.86,14.22 22.86,12.95 Q4.2 | R2.2 26.03,10.17 25.78,10.29 24.77,10.29 | Q4.1 23.5,11.56
  Top 2.54: Q4.1 22.79,11.74 22.86,11.81 22.86,12.95
  Top 3.81: 23.5,11.56 24.77,10.29
  Bottom 0.254: 29.46,7.62 29.59,7.62 30.35,6.86 31.24,6.86 31.37,6.99 R22.2
  Bottom 0.305: v28.96,7.62 29.46,7.62
N$40
  Top 0.61: C11.1 27.56,22.99 27.94,22.61 U$2.2
N$41
  Top 0.61: Q4.4 23.24,15.49 24.38,17.14 28.57,17.14 29.21,16.51 U$2.8 29.21,15.11
N$42
  Bottom 0.254: C28.1 1.72,33.97 2.61,33.08 IC5.5
N$43
  Bottom 0.254: 1.65,32.13 1.52,32.26 | C27.1 1.65,32.13 | IC5.2 2.66,31.13 1.65,32.13
  Bottom 0.305: 1.65,31.88 1.72,31.94 C27.1
N$44  (via drill 0.61)
  Top 0.254: 7.62,32.13 C29.1 v6.22,32.13
  Bottom 0.254: IC5.3 5.87,31.78 v6.22,32.13
N$45  (via drill 0.61)
  Top 0.254: 7.62,34.29 C42.1 v6.35,34.67
  Bottom 0.254: IC5.7 6.14,34.38 v6.35,34.67
N$46  (via drill 0.61)
  Top 0.254: v40.26,40.01 39.37,39.12 28.96,39.12 28.57,38.73 20.83,38.73 v20.07,37.97
  Bottom 0.254: IC5.15 9.96,33.73 9.78,33.91 9.78,36.7 10.16,37.08 19.18,37.08 v20.07,37.97 20.07,38.35 19.94,38.48 19.94,38.99 19.49,39.43 R30.2 | IC1.9 41.01,40.75 v40.26,40.01
N$47  (via drill 0.61)
  Top 0.254: v41.66,40.01 41.66,39.75 40.51,38.61 29.46,38.61 28.7,37.85 v21.59,37.85 | R29.2 13.34,37.85 v13.34,36.2
  Bottom 0.254: IC1.10 41.81,39.78 v41.66,40.01 | v21.59,37.85 20.32,36.58 14.73,36.58 13.84,35.69 | IC5.13 13.18,35.03 13.84,35.69 | 13.84,35.69 13.72,35.69 13.72,35.81 v13.34,36.2
N$48
  Top 0.254: R27.1 24.45,33.08 24.38,33.15 24.26,33.02 23.37,33.02 | R16.2 23.37,33.02 | 23.37,33.02 23.37,33.15 23.3,33.08 C54.1
N$49
  Top 0.254: R25.2 23.37,34.54 | 23.37,34.54 R26.1 | C53.1 23.3,34.48 23.37,34.54
N$50  (via drill 0.61)
  Top 0.254: IC10.3 15.86,27.8 16.89,28.83 v16.89,28.96
  Bottom 0.254: R23.2 22.61,34.67 v16.89,28.96
N$51
  Top 0.254: R45.1 45.09,39.62 45.85,40.39 45.85,43.18 47.37,44.7 47.37,45.21 48.13,45.97 SJ2.1 48.9,45.59 | 48.9,45.59 48.9,46.74 | 48.9,45.59 48.9,45.47
N$52  (via drill 0.61)
  Top 0.254: v30.1,32 29.08,33.02 27.56,33.02 | 27.56,33.02 C39.1 | R27.2 27.56,33.02
  Bottom 0.254: IC1.34 30.29,31.81 v30.1,32
N$53  (via drill 0.61)
  Top 0.254: v31.24,32.77 29.72,34.29 27.81,34.29 27.62,34.48 C26.1 27.56,34.42 27.43,34.54 R26.2
  Bottom 0.254: IC1.35 31.39,32.61 v31.24,32.77
N$55  (via drill 0.61)
  Top 0.254: v5.46,43.56 X6.3
  Bottom 0.254: v5.46,43.56 R31.1 5.46,45.47
N$56  (via drill 0.61)
  Top 0.254: v8,43.56 8,45.09 8.13,45.21 8.13,45.85 X6.5
  Bottom 0.254: R32.1 v8,43.56
N$67  (via drill 0.61)
  Top 0.254: Q1.3 12.45,18.41 11.43,18.16 | Q1.2 10.86,18.41 Q1.1 | Q2.5 13.72,15.56 13.72,15.37 | 14.48,15.62 R5.2
  Top 0.406: Q2.8 9.78,15.43 | 9.78,15.43 Q2.7 | Q2.7 Q2.6 | 9.78,15.43 9.78,15.37 | Q2.7 11.05,15.43 | 9.78,15.43 11.05,15.43 | 11.05,15.43 11.05,15.37 | Q1.1 9.65,16.51 9.02,15.88 9.02,16 8.89,16.13 4.45,16.13 3.17,17.4 U$1.4
  Top 0.61: C10.2 3.68,20.83 3.17,20.32 U$1.4
  Top 1.27: 14.48,15.37 14.48,15.62
  Top 1.778: 11.18,16.76 11.43,16.76 v11.68,16.76
  Top 2.54: Q1.1 Q2.8 9.65,15.37 13.72,15.37 14.48,15.37 | Q1.2 11.36,18.23 11.43,18.16 11.43,16.76 11.43,16.64 11.68,16.38
  Bottom 1.778: v11.68,16.76 14.73,15.49
N$69  (via drill 0.61)
  Top 0.254: 64.26,7.62 R37.2 64.14,7.5 64.14,7.49 62.61,5.97 v62.61,5.59
  Top 0.61: 64.14,7.49 64.14,7.5
  Top 1.016: Q6.2 64.96,11.36 65.02,11.43 64.96,11.5 Q6.3
  Top 2.54: 65.02,11.3 65.02,11.43 65.02,11.68 | 65.02,11.3 Q6.2 | 65.02,11.3 65.02,10.03 Q6.1 64.14,10.03 64.14,7.5 R37.2
  Bottom 0.254: 62.74,5.46 v62.61,5.59 62.61,5.71 63.82,6.92 R20.1
N$72
  Top 0.61: C45.1 69.47,19.43 70.1,18.8 U$18.2
N$73
  Top 2.184: X4.1 53.59,6.35 51.94,4.7 R36.2
  Bottom 1.016: C48.1 54.36,7.49 X4.1 53.59,6.48 53.72,6.35 53.72,5.46 54.08,5.1 TR2.P$2
  Bottom 1.778: 52.32,5.21 51.69,4.57
  Bottom 2.184: 52.32,5.21 52.32,5.46 X4.1
N$74
  Top 0.61: Q6.4 70.48,13.84 71.37,12.95 U$18.8
N$77  (via drill 0.61)
  Top 0.254: Q7.3 46.16,9.21 | R38.2 46.35,6.48 45.09,5.21 44.96,5.21 v44.7,4.95 | R38.2 | R38.2 46.23,7.49
  Top 0.305: 46.23,7.49 47.12,7.49
  Top 2.54: Q7.1 Q7.2 46.16,9.21 | 46.16,9.21 46.42,9.21 46.48,9.27 | 46.16,9.21 46.48,8.89 46.23,8.64 46.23,7.49
  Bottom 0.254: R24.2 44.7,5.21 v44.7,4.95
N$78
  Top 0.61: Q8.4 50.99,17.59 52.45,16.13 54.1,16.13 54.48,16.38 U$17.3
N$79
  Top 0.254: R5.1 14.86,5.46 14.86,5.59
  Top 1.016: 14.86,5.59 15.37,5.59
  Top 1.778: 14.86,5.59 15.88,6.6
  Top 2.54: X3.1 16.64,6.86 15.37,5.59 | 14.86,5.59 16.13,6.86
  Bottom 1.016: TR1.P$1 18.14,5.35 17.4,6.1 X3.1 17.4,7.37 C9.2
  Bottom 2.54: X3.1 15.75,6.48
N$81
  Top 0.61: C51.1 54.93,20.26 55.75,19.43 U$17.2
N$82
  Top 0.61: Q7.4 52.26,9.21 52.58,9.4 55.63,9.4 57.02,10.92 U$17.8
N$87
  Top 0.406: 66.04,15.37 66.17,15.24
  Top 0.61: Q5.4 64.45,16.96 66.04,15.37 | U$18.3 68.83,15.62 68.45,15.24 66.17,15.24
PWM_LAH  (via drill 0.61)
  Top 0.254: v41.66,31.62 41.02,30.86 41.02,28.7 40.51,28.19 32.13,28.19 30.86,29.46 27.94,29.46 27.43,29.97 26.42,29.97 25.27,28.83 20.83,28.83 19.3,30.35 12.57,30.35 4.45,22.23 3.05,22.23 2.03,21.21 2.03,14.73 3.17,13.59 U$1.5
  Bottom 0.254: IC1.25 41.01,30.85 v41.66,31.62
PWM_LAL  (via drill 0.61)
  Top 0.254: v40.26,31.62 40.26,28.96 40.01,28.7 32.51,28.7 31.24,29.97 28.45,29.97 27.94,30.48 26.04,30.48 24.89,29.34 21.21,29.34 19.68,30.86 12.19,30.86 4.06,22.73 2.67,22.73 1.52,21.59 1.52,12.83 2.41,11.94 3.56,11.94 4.32,12.7 U$1.6 4.45,13.59
  Bottom 0.254: IC1.26 40.21,31.32 v40.26,31.62
PWM_LBH  (via drill 0.81 pad 1.27)  (1 unrouted)
  Top 0.254: v44.07,28.19 44.2,27.94 | U$2.5 25.4,13.84 26.04,13.21 v25.91,13.21
  Bottom 0.254: IC1.23 42.61,29.78 42.99,29.78 44.07,28.7 v44.07,28.19 | v25.91,13.21 26.04,13.21
PWM_LBL  (via drill 0.81 pad 1.27)  (1 unrouted)
  Top 0.254: v42.42,28.19 42.16,27.94 | U$2.6 26.67,14.1 27.56,13.21 v27.56,12.57
  Bottom 0.254: IC1.24 41.81,28.8 v42.42,28.19
PWM_RAH  (via drill 0.61)
  Top 0.254: v67.56,9.53 U$18.5 | v50.16,27.69 v50.16,34.29
  Bottom 0.254: IC1.15 48.69,37.41 50.16,35.94 v50.16,34.29 | v50.16,27.69 51.44,27.69 51.56,27.81 55.37,27.81 55.63,28.07 59.69,28.07 59.94,27.81 67.56,27.81 | 67.56,27.81 67.82,27.81 | v67.56,9.53 72.9,14.86 72.9,21.34 73.66,22.1 73.66,22.86 68.71,27.81 67.56,27.81
PWM_RAL  (via drill 0.61)
  Top 0.254: v68.83,9.53 U$18.6 | v48.77,28.07 49.66,28.96 49.66,32.26 49.28,32.64 v49.28,33.15
  Bottom 0.254: 68.83,9.65 v68.83,9.53 68.83,10.03 73.41,14.61 73.41,21.08 74.17,21.84 74.17,23.11 68.96,28.32 66.8,28.32 | v48.77,28.07 49.15,28.07 49.66,28.57 50.67,28.57 50.93,28.32 55.12,28.32 55.37,28.57 59.94,28.57 60.2,28.32 66.8,28.32 | 66.8,28.32 67.18,28.32 | IC1.16 48.09,36.61 49.28,35.43 v49.28,33.15
PWM_RBH  (via drill 0.81 pad 1.27)  (1 unrouted)
  Top 0.254: v53.21,10.67 U$17.5
  Bottom 0.254: v53.21,10.67 53.21,11.18 | IC1.21 45.74,32.61 45.97,32.38 47.12,32.38 v47.5,32.26
PWM_RBL  (via drill 0.81 pad 1.27)  (1 unrouted)
  Top 0.254: v54.74,10.67 54.48,10.79 U$17.6
  Bottom 0.254: v54.74,10.67 54.61,11.18 | IC1.22 45.53,31.81 v46.1,31.37
PWR_VIN  (via drill 0.61)
  Top 0.254: Q1.8 9.91,23.5 10.92,23.5 | 37.72,13.72 37.85,12.7 | 45.59,21.72 45.47,20.64 | Q3.6 20.07,23.81 21.08,23.62 | Q1.6 12.45,23.5 12.45,23.55 | 13.72,23.55 13.72,23.5 Q1.5 13.46,23.62 13.59,23.75 14.03,23.3 C57.1 | Q3.8 17.53,23.81 17.53,23.55 | Q3.7 18.8,23.81 18.8,23.55 | Q8.5 48.64,22.86 48.64,21.72 | Q5.8 59.75,22.23 59.75,22.86 | Q5.7 61.02,22.23 61.02,22.86 | Q5.5 63.56,22.23 62.36,22.23 | C58.1 23.05,25.34 23.11,25.4 | 41.08,19.11 41.02,19.18 41.77,19.92 C59.1 | 60.83,22.86 60.83,22.73 61.21,23.11 C60.1
  Top 0.406: Q1.8 9.53,23.43 9.53,23.5 | Q8.8 44.7,22.86 44.77,22.79 Q8.7
  Top 0.61: 58.29,22.86 D6.A
  Top 2.54: 39.37,9.14 39.37,11.56 37.72,13.21 | 37.72,13.21 37.72,11.43 | 37.72,11.43 37.72,10.79 | 37.72,10.79 39.37,9.14 | 39.37,9.14 38.73,9.14 | 38.73,9.14 38.61,9.27 40.01,9.27 40.77,10.03 40.77,10.16 | 40.77,11.43 40.77,10.16 | 40.77,11.43 40.77,14.1 41.02,14.35 v41.02,15.11 41.02,19.05 41.08,19.11 44.7,22.73 Q8.8 | Q8.7 45.97,22.1 45.59,21.72 48.64,21.72 49.53,21.72 50.29,22.48 | 50.29,22.48 50.67,22.86 58.29,22.86 59.75,22.86 60.83,22.86 61.02,22.86 61.72,22.86 62.36,22.23 62.29,22.16 Q5.6 | Q8.6 Q8.5 49.98,22.79 50.29,22.48 | 37.72,13.21 37.72,13.72 35.18,16.26 35.05,16.26 33.91,17.4 33.91,19.18 31.37,21.84 31.37,23.11 31.11,23.37 31.24,23.5 29.34,25.4 23.11,25.4 22.86,25.4 21.08,23.62 Q3.5 | 39.24,10.29 38.23,10.29 37.72,10.79 | 37.72,10.79 v37.72,10.41 | 38.73,9.14 37.72,10.16 | 38.73,9.14 38.73,8.89 38.86,8.76 38.86,6.48 | 39.24,9.53 39.24,8.51 38.86,8.13 38.86,6.48 | 40.64,7.24 40.77,7.37 40.77,9.27 39.75,9.27 39.12,9.91 | 38.86,6.48 39.37,5.97 40.58,7.18 | 40.64,7.24 40.58,7.18 | 40.64,7.24 40.64,11.3 40.77,11.43 | 37.72,11.43 40.77,11.43 | 37.72,11.43 v37.72,10.41 | v37.72,10.41 37.72,10.16 | 37.72,10.16 40.77,10.16 | 40.77,10.16 40.77,8.76 40.51,8.51 | Q1.7 10.92,23.5 10.98,23.55 12.45,23.55 13.72,23.55 Q3.8 17.53,23.55 Q3.7 18.8,23.55 Q3.6 | X1.2 40.13,6.86 40.13,5.97 40.77,5.97 40.77,7.18 40.58,7.18
  Bottom 0.254: v41.02,15.11 41.97,15.56 | D4.C 37.72,12.7 37.97,12.7
  Bottom 0.406: v36.7,15.11 36.96,15.11 36.96,14.61 | 39.62,11.18 39.37,11.18 39.37,12.32 v39.5,12.32 | 40.77,10.03 40.89,10.03 40.89,10.41 v40.64,10.41
  Bottom 2.54: v41.02,15.11 40.77,14.86 40.77,14.22 39.88,13.34 39.88,11.43 39.62,11.18 | 36.96,14.73 36.96,14.61 36.96,14.48 37.72,13.72 37.72,12.7 v37.72,10.41 37.72,10.03 37.97,10.03 39.12,8.89 38.99,8.89 38.86,8.76 38.86,6.48 39.37,5.97 | 41.02,14.73 41.02,14.35 40.77,14.1 40.77,10.03 40.77,7.37 39.62,7.37 39.62,5.97 40.77,5.97 40.77,6.86 X1.2
RST*
  Bottom 0.254: IC1.4 37.01,40.56 36.58,40.13 34.29,40.13 33.27,41.15 D5.3 33.23,42.97 32.64,43.56 29.97,43.56 29.46,43.05 29.46,42.67 | 29.46,42.67 R11.1 | 26.29,42.8 29.34,42.8 29.46,42.67 | 26.29,42.8 C40.2 | 26.29,42.8 25.02,44.07 SV1.5
RXD  (via drill 0.61)
  Top 0.254: v11.94,33.4 14.35,35.81 14.35,37.72 15.62,38.99 15.62,39.75 v15.88,40.01 | SV1.4 22.1,47.24 20.83,45.97 19.18,45.97 v17.91,44.7
  Bottom 0.254: IC5.16 11.36,33.08 v11.94,33.4 | v15.88,40.01 15.81,40.07 R34.2 17.46,40.07 17.59,40.07 | 17.59,40.07 18.16,40.64 18.16,41.53 17.91,41.78 v17.91,44.7 | 17.59,40.07 17.78,39.81 17.78,39.62 R30.1
SCL  (via drill 0.61)
  Top 0.254: v46.61,34.92 46.99,34.92 48.77,36.7 51.31,36.7 52.7,38.1 52.7,43.69 51.31,45.09 v51.31,46.23
  Bottom 0.254: IC1.19 45.77,34.21 46.35,34.8 46.48,34.8 v46.61,34.92 | X2.4 56.26,47.24 55.12,46.1 54.23,46.1 54.1,46.23 53.98,46.23 53.72,46.48 51.56,46.48 v51.31,46.23
SDA  (via drill 0.61)
  Top 0.254: v46.61,33.53 46.61,33.66 47.5,34.54 47.5,34.67 49.02,36.2 51.69,36.2 53.21,37.72 X2.1
  Bottom 0.254: IC1.20 46.49,33.41 v46.61,33.53
SPI_CLK/DIR_L
  Bottom 0.254: IC1.3 36.21,42.79 33.27,45.72 33.27,46.74 31.62,48.39 28.96,48.39 | R32.2 8.57,46.93 8.89,46.61 17.14,46.61 | 17.14,46.61 8.76,46.61 | 28.96,48.39 18.92,48.39 17.14,46.61 | SV1.7 27.69,44.7 28.96,45.97 28.96,48.39
SPI_CS  (via drill 0.61)
  Top 0.254: v21.08,41.02 20.32,41.78 19.81,41.78 18.92,42.67 17.14,42.67 16,43.81 16,46.23 15.43,46.8 R44.2
  Bottom 0.254: IC1.44 28.13,39.81 26.67,41.27 21.34,41.27 v21.08,41.02
SPI_MISO  (via drill 0.61)
  Top 0.254: X6.7 10.79,46.23 10.79,47.12 11.94,48.26 15.75,48.26 16.51,47.5 16.51,44.07 17.4,43.18 19.18,43.18 20.07,42.29 21.21,42.29 22.1,41.4 26.54,41.4 29.59,44.45 29.59,44.7 SV1.9 30.48,44.7 32.13,46.35 v32.26,46.35
  Bottom 0.254: IC1.2 35.41,42.7 32.26,45.85 v32.26,46.35
SPI_MOSI/DIR_R
  Bottom 0.254: IC1.1 34.61,42.61 31.24,45.97 29.72,45.97 28.83,45.09 28.83,44.2 28.19,43.56 26.92,43.56 26.29,44.2 26.29,45.34 25.78,45.85 21.21,45.85 20.07,44.7 SV1.1 19.94,45.34 19.18,46.1 6.6,46.1 5.78,46.93 R31.2
TXD  (via drill 0.61)
  Top 0.254: R29.1 11.62,37.91 11.81,38.1 11.81,39.62 | 11.81,39.62 X6.8 11.81,42.29 11.3,42.8 v11.3,43.31 | 11.81,39.62 11.68,39.62 10.29,38.23 v10.16,38.23 | v21.08,43.69 21.08,44.96 22.23,46.1 26.29,46.1 27.43,47.24 SV1.8
  Bottom 0.254: IC5.17 10.12,32.43 9.27,33.27 9.27,37.34 v10.16,38.23 | v11.3,43.31 12.57,43.31 14.86,45.59 18.41,45.59 18.8,45.21 18.8,44.2 19.43,43.56 20.95,43.56 v21.08,43.69
VBAT_F  (via drill 0.61)
  Top 0.254: 54.86,31.62 54.8,31.69 C30.1 | R4.1 56.13,31.75 56.07,31.69 C30.1 | C30.1 54.74,31.62 v53.34,31.62
  Bottom 0.254: 34.61,30.04 34.67,30.1 34.67,30.86 36.83,33.02 41.66,33.02 42.8,31.88 42.8,31.62 44.83,29.59 46.61,29.59 47.24,30.23 48.39,30.23 49.78,31.62 v53.34,31.62 | 34.61,30.04 IC1.33 | 34.61,30.04 34.35,29.78 34.35,29.4 33.34,28.39 C41.1 | C41.1 33.15,28.32 33.11,28.36 R18.2 | C41.1 33.15,28.45 33.4,28.19 v33.4,27.18
VCC  (via drill 0.61)
  Top 0.254: 30.73,18.91 30.86,19.05 30.86,18.8 31.26,18.4 | C3.1 7.81,20.89 8.51,21.59 8.51,21.97 | 8.51,21.97 8.51,24.38 9.78,25.65 18.92,25.65 21.08,27.81 30.48,27.81 34.92,23.37 41.53,23.37 43.43,25.27 48.39,25.27 48.51,25.4 52.07,25.4 52.83,24.64 56.26,24.64 57.15,25.53 57.15,27.18 57.66,27.69 | 29.21,20.32 29.21,23.11 28.57,23.75 23.88,23.75 21.72,21.59 18.03,21.59 17.02,20.57 14.61,20.57 13.59,21.59 8.89,21.59 8.51,21.97
  Top 0.406: 57.15,18.16 59.05,20.07 63.88,20.07 | C3.1 7.24,20.95 6.99,20.7 U$1.1 | 71.37,16.89 U$18.1 71.37,19.3 | 71.37,19.3 71.37,19.56 70.1,20.83 64.64,20.83 63.88,20.07 | 57.66,27.69 58.04,27.69 59.82,29.46 59.82,31.24 61.34,32.77 | C44.1 71.44,19.37 71.37,19.3 | 63.88,20.07 63.88,20.19 68.33,24.64 68.33,32.13 v67.06,33.4 66.42,32.77 61.34,32.77 | 30.86,19.05 30.61,19.05 29.21,20.32 | v69.47,41.02 69.47,40.89 70.1,40.26 70.1,38.48 70.23,38.35 D3.3 | 61.34,32.77 61.59,32.77 v61.59,34.04 | C8.+ 73.53,37.08 74.3,37.85 74.93,37.85 75.5,38.42 C52.1
  Top 0.61: C4.1 31.37,18.29 31.31,18.35 30.73,18.91 U$2.1 | U$17.1 57.02,18.03 57.15,18.16 57.28,18.29 v57.28,20.32 | v67.06,33.4 69.34,35.69 70.1,35.69 | C8.+ 73.53,35.94 73.28,35.69 70.1,35.69 | D3.3 70.19,35.77 70.1,35.69
  Bottom 0.254: 61.66,32.19 61.59,32.26 | 61.66,32.19 D1.1 61.68,33.83 61.47,34.04 v61.59,34.04 | D1.2 61.68,32.17 61.66,32.19
  Bottom 0.406: R33.2 70.74,42.42 70.61,42.29 C21.1 70.68,40.96 70.61,40.89 U$3.1 69.47,40.45 v69.47,41.02 69.28,40.83
  Bottom 0.61: C20.1 57.07,20.12 v57.28,20.32 | v61.59,34.04 61.59,34.92 61.85,35.18 61.85,35.56 61.98,35.69 U$6.8
VCOM_L  (via drill 0.61)
  Top 0.254: 19.81,34.67 19.85,34.71 R25.1 19.88,34.61 19.81,34.67 | 19.81,34.67 18.54,34.67 17.78,33.91 17.14,33.91 16.51,34.54 16.51,36.58 v17.91,37.97 | X6.4 v6.73,43.56
  Bottom 0.254: v17.91,37.97 16.89,38.99 12.95,38.99 11.3,40.64 8.38,40.64 6.73,42.29 v6.73,43.56
VCOM_R  (via drill 0.61)
  Top 0.254: 19.94,33.02 R16.1 17.27,33.02 16,34.29 16,37.34 v16.64,37.97 | X6.2 4.32,40.89 4.19,41.02 v4.19,43.56
  Bottom 0.254: v16.64,37.97 13.21,37.97 11.18,40.01 6.6,40.01 4.19,42.42 v4.19,43.56
VREF_L
  Bottom 0.254: 8.41,12.92 8.51,12.95 | 8.41,12.92 8.41,14.63 8.51,14.73 8.64,14.73 | 30.23,3.68 30.26,3.71 IC3.1 | 26.92,4.45 26.16,3.68 25.91,3.68 24.38,2.16 11.18,2.16 10.54,2.79 | 10.54,2.79 10.03,3.3 | 10.54,2.79 9.78,3.56 9.78,6.73 7.37,9.14 7.37,12.45 7.81,12.89 IC2.1 8.41,12.92 | 8.41,12.92 8.38,12.95 8.45,13.27 C12.1 | 8.64,25.78 8.64,26.29 9.14,26.8 17.53,26.8 18.29,27.56 19.68,27.56 19.81,27.69 29.72,27.69 31.62,25.78 34.04,25.78 34.42,26.16 36.58,26.16 37.47,27.05 38.48,27.05 40.01,25.53 42.29,25.53 43.31,26.54 45.09,26.54 47.62,29.08 53.34,29.08 54.23,29.97 54.23,30.86 54.36,30.99 54.36,37.08 53.72,37.72 C23.1 52.01,37.4 52.07,37.59 R17.1 51.65,37.38 50.67,38.35 | 50.67,38.35 50.29,38.73 | 50.67,38.35 R10.1
  Bottom 0.305: 26.92,4.45 29.21,4.45 29.46,4.19 | IC3.1 30.03,3.74 29.97,3.68 29.46,4.19 | C13.2 28.38,5.27 29.46,4.19 | 8.64,14.73 8.64,25.78
VREF_R
  Bottom 0.254: 46.29,4.26 46.35,4.32 | 46.29,4.26 IC14.1 46.29,3.49 46.61,3.17 49.15,3.17 50.04,1.91 65.28,1.91 65.76,2.38 IC13.1 66.36,4 67.31,4.95 67.31,6.73 67.82,7.24 | C49.2 45.21,3.17 46.29,4.26 | 67.82,7.24 68.96,7.24 73.91,12.19 73.91,20.83 74.68,21.59 74.68,23.37 69.22,28.83 60.45,28.83 60.2,29.08 56.52,29.08 56.01,29.59 56.01,40.39 54.04,42.35 C38.1 52.26,42.1 52.2,42.29 52.11,42.38 R19.1 51.4,42.12 50.38,41.11 R9.1 | C46.1 67.63,7.18 67.82,7.24
VTEMP_L
  Bottom 0.254: R23.1 25.72,35.37 26.04,35.69 27.56,35.69 28.57,34.67 C32.1 30.35,34.67 30.73,34.29 32,34.29 32.08,34.21 IC1.37
VTEMP_R
  Bottom 0.254: IC1.36 31.99,33.41 31.62,33.78 28.96,33.78 28.57,33.4 C25.1 28.7,33.4 28.64,33.34 R6.1

## Text on the board
Top: 2009 | PP | Motor-Power 3 | APBTeam
_tsilk: Dev | I2C | LED1 | LED2 | Cmd | LED3 | LED4 | PWR_Led | Bat | - | Left | - | + | + | - | + | 12/28V-2x15A | Right